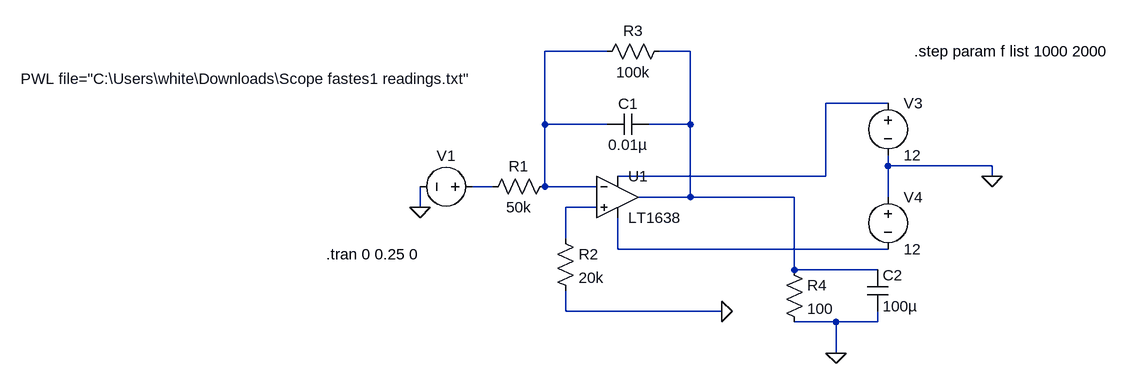
[diagram p0: schematic Cody_Integrator_Circuit.asc]
Cody_Integrator_Circuit.asc, the LTspice schematic file:
Version 4
SHEET 1 1172 680
WIRE 240 -64 144 -64
WIRE 368 -64 320 -64
WIRE 672 16 576 16
WIRE 144 48 144 -64
WIRE 240 48 144 48
WIRE 368 48 368 -64
WIRE 368 48 304 48
WIRE 672 112 672 96
WIRE 832 112 672 112
WIRE 576 128 576 16
WIRE 576 128 256 128
WIRE 832 128 832 112
WIRE 64 144 32 144
WIRE 144 144 144 48
WIRE 224 144 144 144
WIRE 368 160 368 48
WIRE 368 160 288 160
WIRE 528 160 368 160
WIRE 672 160 672 112
WIRE -48 176 -48 144
WIRE 224 176 176 176
WIRE 176 224 176 176
WIRE 256 240 256 192
WIRE 672 240 256 240
WIRE 528 272 528 160
WIRE 656 272 528 272
WIRE 176 336 176 304
WIRE 416 336 176 336
WIRE 592 352 528 352
WIRE 656 352 656 336
WIRE 656 352 592 352
WIRE 592 400 592 352
FLAG 416 336 0
FLAG -48 176 0
FLAG 832 128 0
FLAG 592 400 0
SYMBOL res 160 128 R90
WINDOW 0 0 56 VBottom 2
WINDOW 3 32 56 VTop 2
SYMATTR InstName R1
SYMATTR Value 50k
SYMBOL cap 304 32 R90
WINDOW 0 0 32 VBottom 2
WINDOW 3 32 32 VTop 2
SYMATTR InstName C1
SYMATTR Value 0.01µ
SYMBOL OpAmps\\LT1638 256 96 R0
SYMATTR InstName U1
SYMBOL voltage 48 144 R90
WINDOW 0 -32 56 VBottom 2
WINDOW 3 -182 363 VTop 2
WINDOW 123 0 0 Left 0
WINDOW 39 0 0 Left 0
SYMATTR InstName V1
SYMATTR Value PWL file="C:\Users\white\Downloads\Scope fastes1 readings.txt"
SYMBOL res 160 208 R0
SYMATTR InstName R2
SYMATTR Value 20k
SYMBOL voltage 672 0 R0
WINDOW 123 0 0 Left 0
WINDOW 39 0 0 Left 0
SYMATTR InstName V3
SYMATTR Value 12
SYMBOL voltage 672 144 R0
WINDOW 123 0 0 Left 0
WINDOW 39 0 0 Left 0
SYMATTR InstName V4
SYMATTR Value 12
SYMBOL res 336 -80 R90
WINDOW 0 0 56 VBottom 2
WINDOW 3 32 56 VTop 2
SYMATTR InstName R3
SYMATTR Value 100k
SYMBOL cap 640 272 R0
SYMATTR InstName C2
SYMATTR Value 100µ
SYMBOL res 512 256 R0
SYMATTR InstName R4
SYMATTR Value 100
TEXT -192 248 Left 2 !.tran 0 0.25 0
TEXT 712 -64 Left 2 !.step param f list 1000 2000

The netlist it stands for:
* Cody_Integrator_Circuit.asc
R1 N001 N004 50k
C1 N002 N001 0.01µ
XU1 N005 N001 N003 N006 N002 LT1638  ; pins In+ In- V+ V- OUT
V1 N004 0 PWL file="C:\Users\white\Downloads\Scope fastes1 readings.txt"
R2 N005 0 20k
V3 N003 0 12
V4 0 N006 12
R3 N002 N001 100k
C2 N002 0 100µ
R4 N002 0 100
.tran 0 0.25 0
.step param f list 1000 2000
.backanno
.end